# EasyEDA Pro project WatchDog.epro

# Schematic Schematic1
Board Name: WatchDog; Create Date: 2026-04-22; Page Name: P1; Project Name: V1; Schematic Name: Schematic1; Update Date: 2026-05-01; Company: 嘉立创EDA; Page Size: A5; Version: V1.0
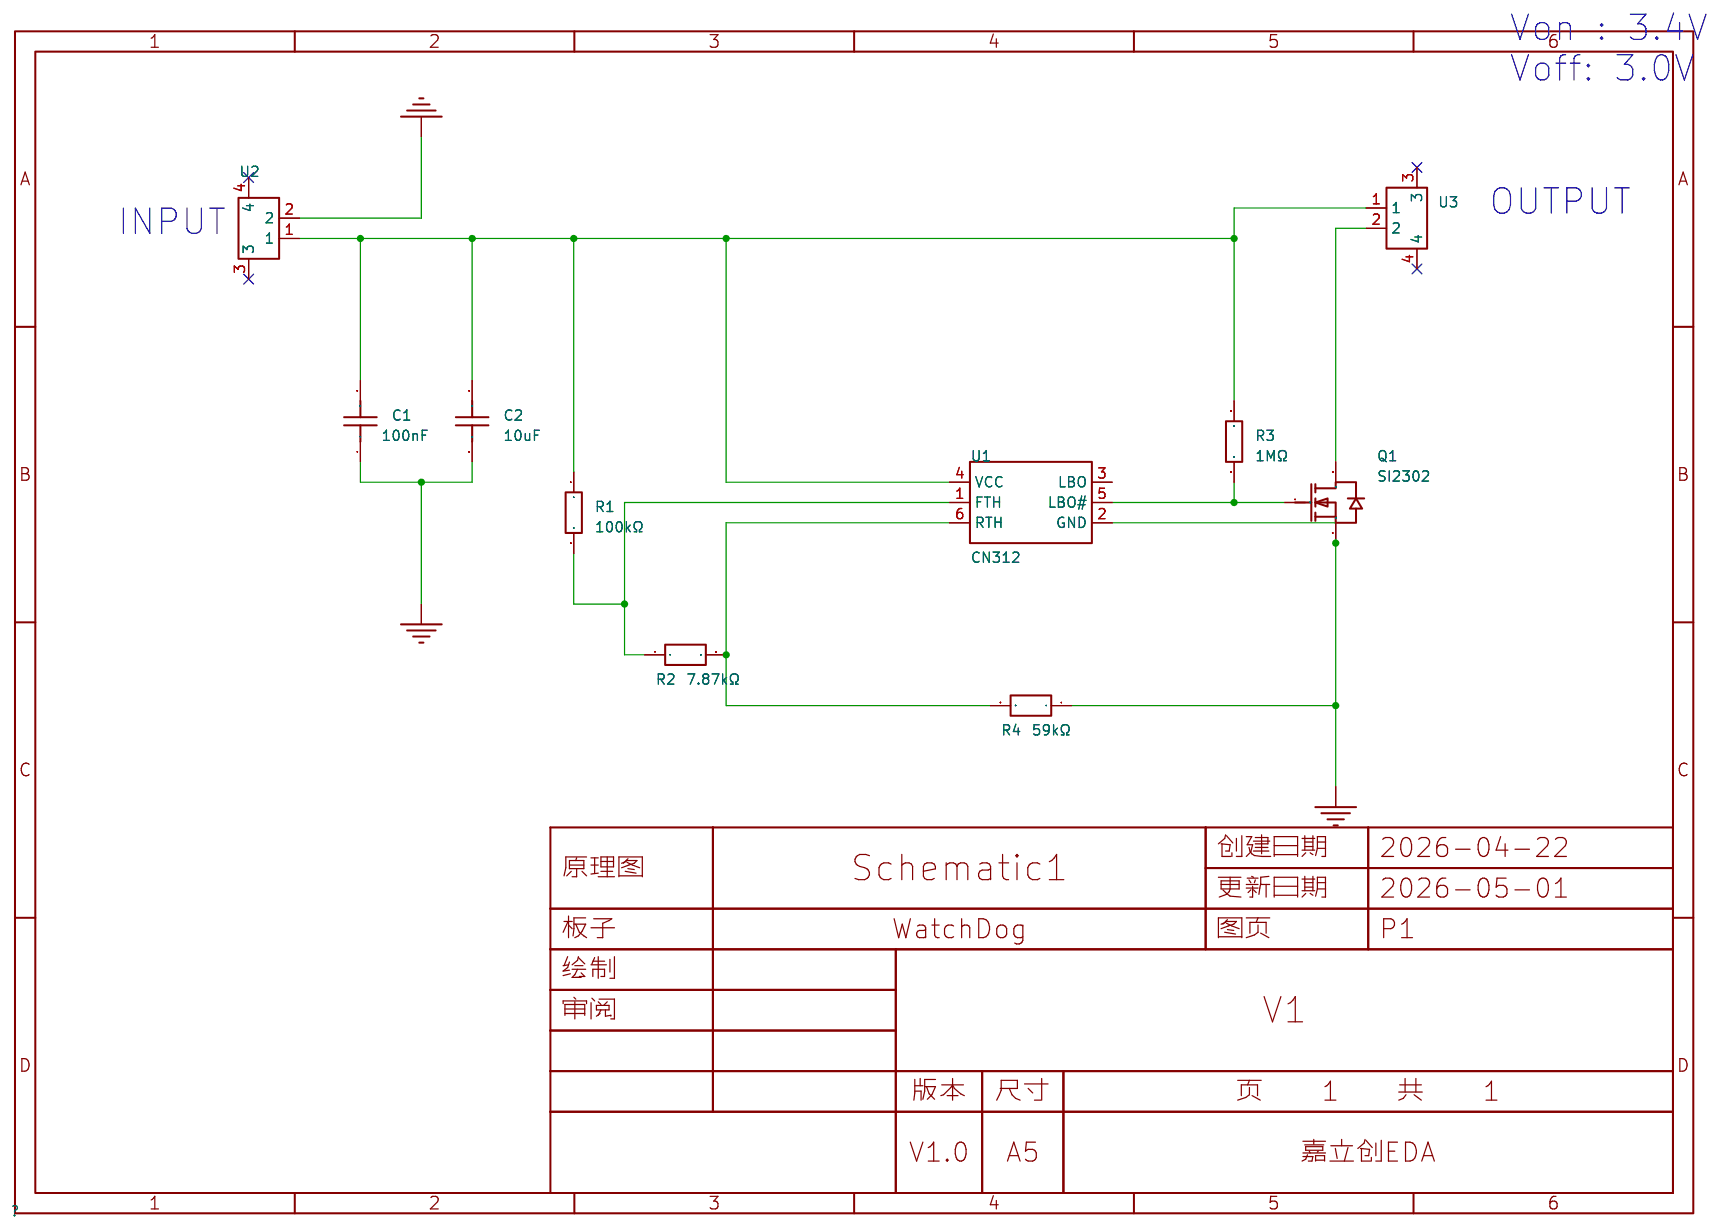
[diagram p0: schematic sheet]

## Parts
C1  100nF  [CAP-SMD_L2.0-W1.25]
C2  10uF  [C0805]
Q1  SI2302  [SOT-23-3_L2.9-W1.3-P1.90-LS2.4-BR]
R1  100kΩ  [R0603]
R2  7.87kΩ  [R0603]
R3  1MΩ  [R0805]
R4  59kΩ  [R0603]
U1  CN312  [SOT-23-6_L2.9-W1.6-P0.95-LS2.8-BL]
U2  532610271  [CONN-SMD_532610271]
U3  532610271  [CONN-SMD_532610271]

## Library data of the parts
C1 = FCC0805B104K500DT: 容值:100nF;精度:±10%;额定电压:50V;温度系数:X7R;; LCSC Part Name: 100nF ±10% 50V; Supplier Part: C5137467; Manufacturer: FOJAN(富捷); Supplier Footprint: 0805; JLCPCB Part Class: Extended Part; Datasheet: https://item.szlcsc.com/datasheet/FCC0805B104K500DT/5746969.html; Supplier: LCSC; Tolerance: ±10%; Voltage Rating: 50V; Temperature Coefficient: X7R
C2 = CL21B106KOQNNNE: 容值:10uF;精度:±10%;额定电压:16V;温度系数:X7R;; LCSC Part Name: 10uF ±10% 16V; Supplier Part: C95841; Manufacturer: SAMSUNG(三星); Supplier Footprint: 0805; JLCPCB Part Class: Extended Part; Datasheet: https://item.szlcsc.com/datasheet/CL21B106KOQNNNE/97045.html; Supplier: LCSC; Tolerance: ±10%; Voltage Rating: 16V; Temperature Coefficient: X7R
Q1 = SI2302_C2891732: 数量:1个N沟道;漏源电压(Vdss):20V;连续漏极电流(Id):3A;导通电阻(RDS(on)):65mΩ@2.5V;耗散功率(Pd):1W;阈值电压(Vgs(th)):1V@250uA;; LCSC Part Name: 1个N沟道 耐压:20V 电流:3A; Supplier Part: C2891732; Manufacturer: YONGYUTAI(永裕泰); Supplier Footprint: SOT-23; JLCPCB Part Class: Extended Part; Datasheet: https://item.szlcsc.com/datasheet/SI2302/3119651.html; Supplier: LCSC; Number: 1个N沟道; Drain to Source Voltage: 20V; Current - Continuous Drain(Id): 3A; RDS(on): 65mΩ@2.5V; Pd - Power Dissipation: 1W; Gate Threshold Voltage (Vgs(th)): 1V@250uA; Gate Charge(Qg): 4nC@4.5V; Input Capacitance(Ciss): 300pF; Reverse Transfer Capacitance (Crss@Vds): 80pF; Operating Temperature: -55℃~+150℃; Type: N沟道; Output Capacitance(Coss): 120pF
R1 = 0603WAF1003T5E: 电阻类型:厚膜电阻;阻值:100kΩ;精度:±1%;功率:100mW;工作电压:75V;温度系数:±100ppm/℃;; LCSC Part Name: 100kΩ ±1% 100mW 厚膜电阻; Supplier Part: C25803; Manufacturer: UNI-ROYAL(厚声); Supplier Footprint: 0603; JLCPCB Part Class: Basic Part; Datasheet: https://item.szlcsc.com/datasheet/0603WAF1003T5E/26546.html; Supplier: LCSC; Type: 厚膜电阻; Tolerance: ±1%; Power(Watts): 100mW; Voltage-Supply(Max): 75V; Temperature Coefficient: ±100ppm/℃; Operating Temperature: -55℃~+155℃
R2 = FRC0603F7871TS: 电阻类型:厚膜电阻;阻值:7.87kΩ;精度:±1%;功率:100mW;工作电压:75V;温度系数:±100ppm/℃;; LCSC Part Name: 7.87kΩ ±1% 100mW 厚膜电阻; Supplier Part: C2930129; Manufacturer: FOJAN(富捷); Supplier Footprint: 0603; JLCPCB Part Class: Extended Part; Supplier: LCSC; Type: 厚膜电阻; Tolerance: ±1%; Power(Watts): 100mW; Voltage-Supply(Max): 75V; Temperature Coefficient: ±100ppm/℃; Operating Temperature: -55℃~+155℃
R3 = 0805W8F1004T5E: 电阻类型:厚膜电阻;阻值:1MΩ;精度:±1%;功率:125mW;最大工作电压:150V;温度系数:±100ppm/℃;; LCSC Part Name: 1MΩ ±1% 125mW 厚膜电阻; Supplier Part: C17514; Manufacturer: UNI-ROYAL(厚声); Supplier Footprint: 0805; JLCPCB Part Class: Basic Part; Datasheet: https://atta.szlcsc.com/upload/public/pdf/source/20200306/C422600_1E6D84923E4A46A82E41ADD87F860B5C.pdf; Supplier: LCSC; Type: 厚膜电阻; Tolerance: ±1%; Power(Watts): 125mW; Overload Voltage (Max): 150V; Temperature Coefficient: ±100ppm/℃; Operating Temperature Range: -55℃~+155℃
R4 = FRC0603F5902TS: 电阻类型:厚膜电阻;阻值:59kΩ;精度:±1%;功率:100mW;工作电压:75V;温度系数:±100ppm/℃;; LCSC Part Name: 59kΩ ±1% 100mW 厚膜电阻; Supplier Part: C2933243; Manufacturer: FOJAN(富捷); Supplier Footprint: 0603; JLCPCB Part Class: Extended Part; Supplier: LCSC; Type: 厚膜电阻; Tolerance: ±1%; Power(Watts): 100mW; Voltage-Supply(Max): 75V; Temperature Coefficient: ±100ppm/℃; Operating Temperature: -55℃~+155℃
U1 = CN312: 工作电压:1.8V~6V;最大充电电流:-;电池类型:镍镉电池；镍氢电池；铅酸电池；锂电池;电池节数:-;; LCSC Part Name: 可调整迟滞的超低功耗电池检测集成电路; Supplier Part: C7495114; Manufacturer: CONSONANCE(上海如韵); Supplier Footprint: SOT-23-6L; JLCPCB Part Class: Extended Part; Datasheet: https://item.szlcsc.com/datasheet/CN312/8559048.html; Supplier: LCSC; Voltage - Supply: 1.8V~6V; Type of Battery: 镍镉电池；镍氢电池；铅酸电池；锂电池; Operating Temperature: -40℃~+85℃; Battery Temperature Detection: 不支持; 0V Battery Charge: 不支持; Supply Current (Iq): 2.7uA; Features: 过放保护
U2 U3 = 532610271_C177225: 插针结构:1x2P;间距:1.25mm;安装方式:卧贴;参考系列:PicoBlade(MX 1.25);总PIN数:2P;排数:1;每排PIN数:2;行距:-;额定电流:1A;触头材质:磷青铜;触头镀层:锡;工作温度:-40℃~+105℃;; LCSC Part Name: 1x2P 间距:1.25mm 卧贴 系列:PicoBlade(MX 1.25); Supplier Part: C177225; Manufacturer: MOLEX; Supplier Footprint: SMD,P=1.25mm,卧贴; JLCPCB Part Class: Extended Part; Datasheet: https://www.molex.com/content/dam/molex/molex-dot-com/products/automated/en-us/salesdrawingpdf/532/53261/532610271_sd.pdf?inline; Supplier: LCSC; Pins Structure: 1x2P; Pitch: 1.25mm; Mounting Type: 卧贴; Reference Series: PicoBlade(MX 1.25); Number of Pins: 2P; Number of Rows: 1; Number of PINs Per Row: 2; Current Rating: 1A; Contact Material: 磷青铜; Contact Plating: 锡; Operating Temperature: -40℃~+105℃; Voltage Rating: 125V; Plastic Material: 玻纤增强PA; Flame Retardant Rating: UL94V-0; Supplementary Features: 辅助焊脚; Color: 白色; Z-Height of the Board: 3.4mm; X-Length of Bottom Edge on Board (Spacing Line): 7.65mm; Y-Width of Bottom Edge on Board: 5.2mm

## Nets
GND: C1.1 C2.2 Q1.2(S) R4.1 U1.2(GND) U2.2
$1N10: C1.2 C2.1 R1.1 R3.2 U1.4(VCC) U2.1 U3.1
$1N13: R1.2 R2.1 U1.1(FTH)
$1N14: R2.2 R4.2 U1.6(RTH)
$1N17: Q1.1(G) R3.1 U1.5(LBO#)
$1N19: Q1.3(D) U3.2

Not connected (* = marked no-connect by the designer): U1 3(LBO); U2 3* 4*; U3 3* 4*

## Notes on the sheet
- Von : 3.4V
  Voff: 3.0V
- OUTPUT
- INPUT

# Board PCB1
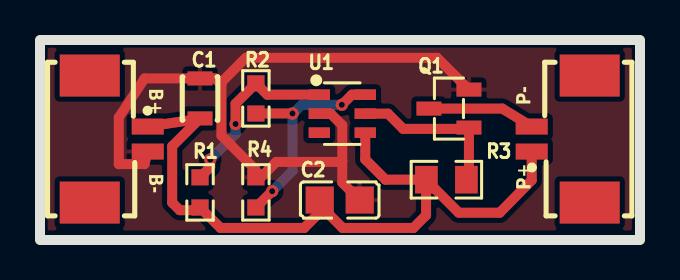
[diagram p1: board, top side]
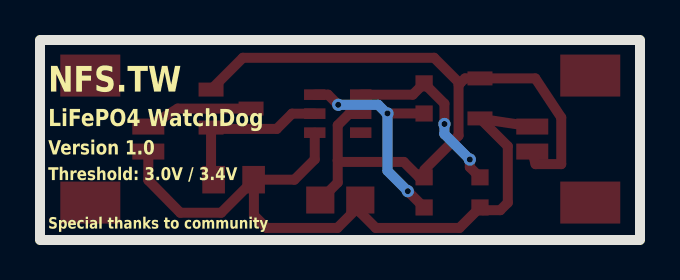
[diagram p2: board, bottom side, seen from below]

Outline 30 x 10 mm; copper layers: Top Layer, Bottom Layer. Coordinates in mm from the lower left corner of the outline.
Outline path: rectangle 0,10 30,0
Stack: Top Layer 0.035mm / Dielectric1 1.51mm FR4 er 4.5 / Bottom Layer 0.035mm

## Design rules (mm)
spacing copperThickness1oz (default): track to track 0.102, other pairs 0.152 to 0.3
spacing copperThickness2oz: track to track 0.203, other pairs 0.152 to 0.3
spacing Plane_innerPlane: track to track 0.102, other pairs 0.152 to 0.3
spacing Copper_copperRegion: track to track 0.102, other pairs 0.152 to 0.3
spacing Copper_copperRegion_copperThickness1oz: track to track 0.102, other pairs 0.152 to 0.3
spacing Copper_copperRegion_Copper_copperRegion: track to track 0.102, other pairs 0.152 to 0.3
track width copperThickness1oz (default): min 0.127, default 0.254, max 2.54
track width copperThickness2oz: min 0.203, default 0.254, max 2.54
differential pair differentialPair (default): width min 0.127, default 0.254, max 2.54; gap min 0.152, default 0.152
net GND uses copperRegion_copperThickness1oz
pour e110 uses Copper_copperRegion, copperRegion_Copper_copperRegion
pour e127 uses Copper_copperRegion, copperRegion_Copper_copperRegion

## Placement (name value [footprint] x y rotation side)
C1  100nF  [CAP-SMD_L2.0-W1.25]  8 7.08 270 top
C2  10uF  [C0805]  14.99 2 0 top
Q1  SI2302  [SOT-23-3_L2.9-W1.3-P1.90-LS2.4-BR]  20.45 6.57 0 top
R1  100kΩ  [R0603]  8 2.38 90 top
R2  7.87kΩ  [R0603]  10.79 7.08 270 top
R3  1MΩ  [R0805]  20.32 3.02 180 top
R4  59kΩ  [R0603]  10.79 2.38 270 top
U1  CN312  [SOT-23-6_L2.9-W1.6-P0.95-LS2.8-BL]  15.11 6.32 270 top
U2  532610271  [CONN-SMD_532610271]  3.94 5.05 90 top
U3  532610271  [CONN-SMD_532610271]  26.03 5.05 270 top

## Footprints (pads in the part's own frame, mm; a bottom-side part is the same pattern mirrored in y, then rotated)
C0805
  rect 1.41x1.35 smd: 1(-1,0) 2(1,0)
CAP-SMD_L2.0-W1.25
  rect 0.7x1.25 smd: 1(-1,0) 2(1,0)
CONN-SMD_532610271
  rect 0.8x1.6 smd: 1(0.625,-1.45) 2(-0.625,-1.45)
  rect 2.1x3 smd: 3(3.175,1.45) 4(-3.175,1.45)
R0603
  rect 0.806x0.864 smd: 1(-0.753,0) 2(0.753,0)
R0805
  rect 1.133x1.377 smd: 1(-1,0) 2(1,0)
SOT-23-3_L2.9-W1.3-P1.90-LS2.4-BR
  rect 1.25x0.7 smd: 1(1,-0.95) 2(1,0.95) 3(-1,0)
SOT-23-6_L2.9-W1.6-P0.95-LS2.8-BL
  rect 0.532x1.072 smd: 1(-0.95,-1.149) 2(0,-1.149) 3(0.95,-1.149) 4(0.95,1.149) 5(0,1.149) 6(-0.95,1.149)

## Nets
As in the schematic.

Pads without a net: U1 3; U2 3 4; U3 3 4

## Via types
v1: diameter 0.61, hole 0.305, Top Layer to Bottom Layer, 5 vias

## Routing (per net, layer and track width the routed paths; a pad name or vN(x,y) marks a point on that pad's centre or on a via; arc(x,y) is an arc through that point)
GND: length 39.6
  Top Layer w0.5: U2.2 5.22,3.79 3.94,3.79 3.94,6.12 5.23,8.08 8.25,8.08 ; R4.1 11.04,3.13 11.81,3.9 15.04,3.9 15.11,3.98 ; 9.01,7.83 8.75,8.08 C1.1 ; 9.01,7.83 10.29,9.11 19.86,9.11 Q1.2 ; 9.01,7.83 9.07,7.76 9.07,5.22 10.78,3.51 ; 15.11,3.98 15.11,2.87 C2.2 ; 15.11,3.98 15.11,5.74 14.53,6.32 U1.2
$1N10: length 36.9
  Top Layer w0.5: U2.1 7.98,6.06 C1.2 6.61,4.69 6.61,1.87 6.98,1.49 7.87,1.49 R1.1 9.03,0.6 13.21,0.6 13.99,1.38 13.99,1.75 15.13,0.6 18.67,0.6 19.3,1.24 19.3,3 ; 19.3,3 20.94,1.36 22.99,1.36 24.59,2.99 U3.1 ; 19.3,3 R3.2 17.28,3.02 16.26,4.03 U1.4
$1N13: length 9.3
  Top Layer w0.5: 13.96,7.27 11.36,7.27 R2.1 9.78,6.82 v1(9.78,5.8) ; v1(8.51,4.02) 8.51,3.64 R1.2
  Bottom Layer w0.5: v1(8.51,4.02) 9.78,5.29 v1(9.78,5.8)
$1N14: length 11.3
  Top Layer w0.5: 16.26,7.27 15.6,7.27 v1(15.09,6.76) ; v1(11.61,2.44) R4.2 ; v1(12.63,6.33) R2.2
  Bottom Layer w0.5: v1(11.61,2.44) 12.63,3.46 v1(12.63,6.33) 12.66,6.33 13.09,6.76 v1(15.09,6.76)
$1N17: length 8.2
  Top Layer w0.5: U1.5 17.4,6.32 18.16,5.56 21.38,5.56 Q1.1 21.45,3.14 R3.1
$1N19: length 5.4
  Top Layer w0.5: Q1.3 23.11,6.57 U3.2

## Copper pours and planes (outline as drawn; the poured copper is in the pictures)
GND on Top Layer: 0.38,9.62 29.59,9.62 29.59,0.47 0.38,0.47
GND on Bottom Layer: 0.38,9.62 29.59,9.62 29.59,0.47 0.38,0.47

## Text on the board
Bottom Silkscreen Layer: Special thanks to community | Threshold: 3.0V / 3.4V | Version 1.0 | LiFePO4 WatchDog | NFS.TW
Top Silkscreen Layer: P+          P- | B+          B-
